# Altium schematic sheet AIR.SchDoc
size A4
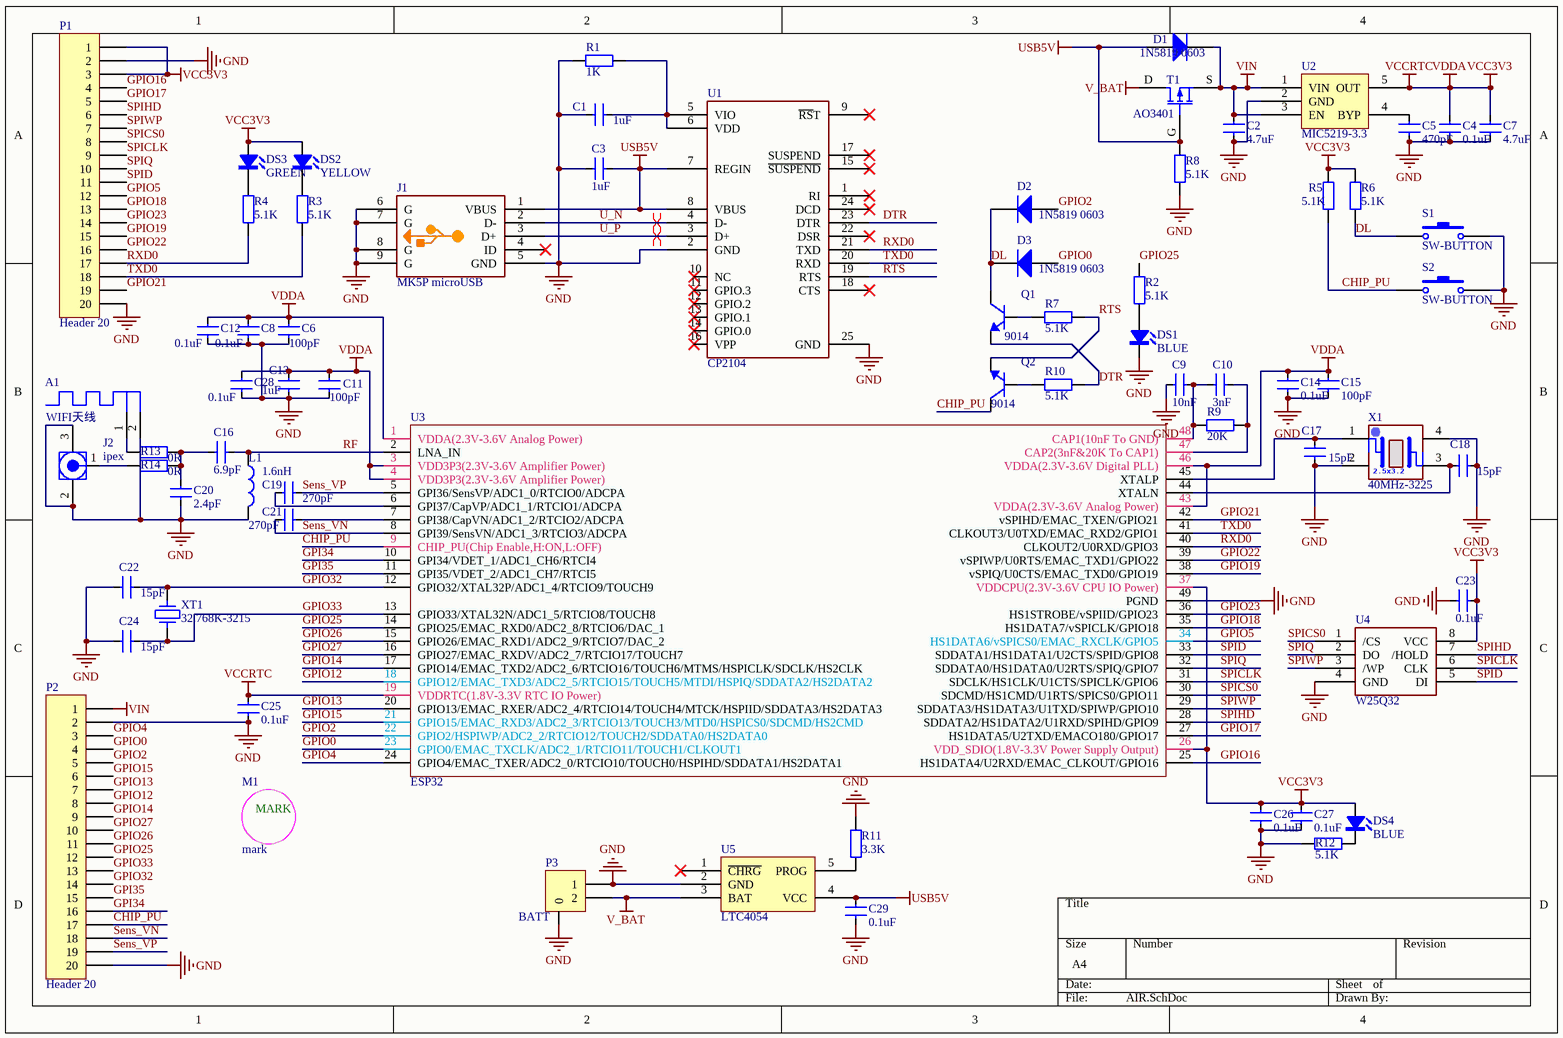
[diagram p0: AIR.SchDoc]

## Parts
A1  WIFI天线  [2.4G]
C1  1uF  [C0402]
C2  4.7uF  [C0603]
C3  1uF  [C0402]
C4  0.1uF  [C0402]
C5  470pF  [C0402]
C6  100pF  [C0402]
C7  4.7uF  [C0603]
C8  0.1uF  [C0402]
C9  10nF  [C0402]
C10  3nF  [C0402]
C11  100pF  [C0402]
C12  0.1uF  [C0402]
C13  1uF  [C0402]
C14  0.1uF  [C0402]
C15  100pF  [C0402]
C16  6.9pF  [C0402]
C17  15pF  [C0402]
C18  15pF  [C0402]
C19  270pF  [C0402]
C20  2.4pF  [C0402]
C21  270pF  [C0402]
C22  15pF  [C0402]
C23  0.1uF  [C0402]
C24  15pF  [C0402]
C25  0.1uF  [C0402]
C26  0.1uF  [C0402]
C27  0.1uF  [C0402]
C28  0.1uF  [C0402]
C29  0.1uF  [C0402]
D1  1N5819 0603  [SOD523]
D2  1N5819 0603  [SOD523]
D3  1N5819 0603  [SOD523]
DS1  BLUE  [LED0402]
DS2  YELLOW  [LED0402]
DS3  GREEN  [LED0402]
DS4  BLUE  [LED0402]
J1  MK5P microUSB  [MICROUSB]
J2  ipex  [I-PEX SOCKET]
L1  1.6nH  [L0402]
M1  mark  [ZY_UR-3X2]
P1  Header 20  [HDR1X20-M]
P2  Header 20  [HDR1X20-M]
P3  BATT  [PH1.25-T]
Q1  9014  [SOT23]
Q2  9014  [SOT23]
R1  1K  [R0402]
R2  5.1K  [R0402]
R3  5.1K  [R0402]
R4  5.1K  [R0402]
R5  5.1K  [R0402]
R6  5.1K  [R0402]
R7  5.1K  [R0402]
R8  5.1K  [R0402]
R9  20K  [R0402]
R10  5.1K  [R0402]
R11  3.3K  [R0402]
R12  5.1K  [R0402]
R13  0R  [R0402]
R14  0R  [R0402]
S1  SW-BUTTON  [MINIBUTTON]
S2  SW-BUTTON  [MINIBUTTON]
T1  AO3401  [SOT23]
U1  CP2104  [QFN24]
U2  MIC5219-3.3  [SOT23-5]
U3  ESP32  [QFN40P600X600X100-48N]
U4  W25Q32  [WSON-SPIFLASH]
U5  LTC4054  [SOT23-5]
X1  40MHz-3225  [XTAL3225]
XT1  32.768K-3215  [Y3215]

## Nets
GND: A1.2(G) C1.2 C2.1 C3.1 C4.1 C5.2 C6.1 C7.1 C8.1 C9.2 C11.1 C12.1 C13.1 C14.1 C15.1 C17.2 C18.2 C20.1 C22.1 C23.2 C24.1 C25.1 C26.1 C27.1 C28.1 C29.1 DS1.K J1.5(GND) J1.6(G) J1.7(G) J1.8(G) J1.9(G) J2.2(GND) J2.3(GND) L1.1 P1.2 P1.20 P2.2 P2.20 P3.0 P3.1 R1.1 R8.1 R11.2 R12.2 S1.2 S2.2 U1.2(GND) U1.25(GND) U2.2(GND) U3.49(PGND) U4.4(GND) U5.2(GND) X1.2(NC1) X1.4(NC2)
USB5V: C3.2 C29.2 D1.A J1.1(VBUS) R8.2 T1.G U1.7(REGIN) U1.8(VBUS) U5.4(VCC)
V_BAT: P3.2 T1.D U5.3(BAT)
VCC3V3: C4.2 C6.2 C7.2 C8.2 C11.2 C12.2 C13.2 C14.2 C15.2 C23.1 C25.2 C26.2 C27.2 C28.2 DS2.A DS3.A DS4.A P1.1 P1.3 R5.1 R6.2 U2.5(OUT) U3.1(VDDA(2.3V-3.6V_Analog_Power)) U3.3(VDD3P3(2.3V-3.6V_Amplifier_Power)) U3.4(VDD3P3(2.3V-3.6V_Amplifier_Power)) U3.19(VDDRTC(1.8V-3.3V_RTC_IO_Power)) U3.26(VDD_SDIO(1.8V-3.3V_Power_Supply_Output)) U3.37(VDDCPU(2.3V-3.6V_CPU_IO_Power)) U3.43(VDDA(2.3V-3.6V_Analog_Power)) U3.46(VDDA(2.3V-3.6V_Digital_PLL)) U4.8(VCC)  [also labelled VCCRTC, VDDA]
VIN: C2.2 D1.K P2.1 T1.S U2.1(VIN) U2.3(EN)
CHIP_PU: P2.17 Q2.C R5.2 S2.1 U3.9(CHIP_PU(Chip_Enable,H:ON,L:OFF))
DL: D2.K D3.K Q1.C R6.1 S1.1
DTR: Q1.E R10.1 U1.23(DTR)
GPI34: P2.16 U3.10(GPI34/VDET_1/ADC1_CH6/RTCI4)
GPI35: P2.15 U3.11(GPI35/VDET_2/ADC1_CH7/RTCI5)
GPIO0: D3.A P2.4 U3.23(GPIO0/EMAC_TXCLK/ADC2_1/RTCIO11/TOUCH1/CLKOUT1)
GPIO2: D2.A P2.5 U3.22(GPIO2/HSPIWP/ADC2_2/RTCIO12/TOUCH2/SDDATA0/HS2DATA0)
GPIO4: P2.3 U3.24(GPIO4/EMAC_TXER/ADC2_0/RTCIO10/TOUCH0/HSPIHD/SDDATA1/HS2DATA1)
GPIO5: P1.12 U3.34(HS1DATA6/vSPICS0/EMAC_RXCLK/GPIO5)
GPIO12: P2.8 U3.18(GPIO12/EMAC_TXD3/ADC2_5/RTCIO15/TOUCH5/MTDI/HSPIQ/SDDATA2/HS2DATA2)
GPIO13: P2.7 U3.20(GPIO13/EMAC_RXER/ADC2_4/RTCIO14/TOUCH4/MTCK/HSPIID/SDDATA3/HS2DATA3)
GPIO14: P2.9 U3.17(GPIO14/EMAC_TXD2/ADC2_6/RTCIO16/TOUCH6/MTMS/HSPICLK/SDCLK/HS2CLK)
GPIO15: P2.6 U3.21(GPIO15/EMAC_RXD3/ADC2_3/RTCIO13/TOUCH3/MTD0/HSPICS0/SDCMD/HS2CMD)
GPIO16: P1.4 U3.25(HS1DATA4/U2RXD/EMAC_CLKOUT/GPIO16)
GPIO17: P1.5 U3.27(HS1DATA5/U2TXD/EMACO180/GPIO17)
GPIO18: P1.13 U3.35(HS1DATA7/vSPICLK/GPIO18)
GPIO19: P1.15 U3.38(vSPIQ/U0CTS/EMAC_TXD0/GPIO19)
GPIO21: P1.19 U3.42(vSPIHD/EMAC_TXEN/GPIO21)
GPIO22: P1.16 U3.39(vSPIWP/U0RTS/EMAC_TXD1/GPIO22)
GPIO23: P1.14 U3.36(HS1STROBE/vSPIID/GPIO23)
GPIO25: P2.12 R2.2 U3.14(GPIO25/EMAC_RXD0/ADC2_8/RTCIO6/DAC_1)
GPIO26: P2.11 U3.15(GPIO26/EMAC_RXD1/ADC2_9/RTCIO7/DAC_2)
GPIO27: P2.10 U3.16(GPIO27/EMAC_RXDV/ADC2_7/RTCIO17/TOUCH7)
GPIO32: C22.2 P2.14 U3.12(GPIO32/XTAL32P/ADC1_4/RTCIO9/TOUCH9) XT1.2
GPIO33: C24.2 P2.13 U3.13(GPIO33/XTAL32N/ADC1_5/RTCIO8/TOUCH8) XT1.1
RF: C16.2 L1.2 U3.2(LNA_IN)
RTS: Q2.E R7.1 U1.19(RTS)
RXD0: P1.17 R4.1 U1.21(TXD) U3.40(CLKOUT2/U0RXD/GPIO3)
Sens_VN: C21.1 P2.18 U3.8(GPI39/SensVN/ADC1_3/RTCIO3/ADCPA)
Sens_VP: C19.2 P2.19 U3.5(GPI36/SensVP/ADC1_0/RTCIO0/ADCPA)
SPICLK: P1.9 U3.31(SDCLK/HS1CLK/U1CTS/SPICLK/GPIO6) U4.6(CLK)
SPICS0: P1.8 U3.30(SDCMD/HS1CMD/U1RTS/SPICS0/GPIO11) U4.1(/CS)
SPID: P1.11 U3.33(SDDATA1/HS1DATA1/U2CTS/SPID/GPIO8) U4.5(DI)
SPIHD: P1.6 U3.28(SDDATA2/HS1DATA2/U1RXD/SPIHD/GPIO9) U4.7(/HOLD)
SPIQ: P1.10 U3.32(SDDATA0/HS1DATA0/U2RTS/SPIQ/GPIO7) U4.2(DO)
SPIWP: P1.7 U3.29(SDDATA3/HS1DATA3/U1TXD/SPIWP/GPIO10) U4.3(/WP)
TXD0: P1.18 R3.1 U1.20(RXD) U3.41(CLKOUT3/U0TXD/EMAC_RXD2/GPIO1)
U_N: J1.2(D-) U1.4(D-)
U_P: J1.3(D+) U1.3(D+)
NetA1_1: A1.1 R13.2
NetC1_1: C1.1 R1.2 U1.5(VIO) U1.6(VDD)
NetC5_1: C5.1 U2.4(BYP)
NetC9_1: C9.1 C10.2 R9.2 U3.48(CAP1(10nF_To_GND))
NetC10_1: C10.1 R9.1 U3.47(CAP2(3nF&20K_To_CAP1))
NetC16_1: C16.1 C20.2 R13.1 R14.1
NetC17_1: C17.1 U3.45(XTALP) X1.1(X1)
NetC18_1: C18.1 U3.44(XTALN) X1.3(X2)
NetC19_1: C19.1 U3.6(GPI37/CapVP/ADC1_1/RTCIO1/ADCPA)
NetC21_2: C21.2 U3.7(GPI38/CapVN/ADC1_2/RTCIO2/ADCPA)
NetDS1_A: DS1.A R2.1
NetDS2_K: DS2.K R3.2
NetDS3_K: DS3.K R4.2
NetDS4_K: DS4.K R12.1
NetJ2_1: J2.1(Signal) R14.2
NetQ1_B: Q1.B R7.2
NetQ2_B: Q2.B R10.2
NetR11_1: R11.1 U5.5(PROG)

Not connected (* = marked no-connect by the designer): J1 4(ID)*; U1 1(RI)* 9(~{RS}T)* 10(NC)* 11(GPIO.3)* 12(GPIO.2)* 13(GPIO.1)* 14(GPIO.0)* 15(~{SUSPEND})* 16(VPP)* 17(SUSPEND)* 18(CTS)* 22(DSR)* 24(DCD)*; U5 1(~{CHRG})*

## Layout directives
differential pair: U_N, U_P

## Notes on the sheet
- (in symbol mark) MARK
- (in symbol XTAL3225) 2.5x3.2

## Library data of the parts
A1 = ANT2.4G
C1-C15 C17-C19 C21-C29 = CAP: 普通小电容
C16 C20 = CAP: 射频电容
D1-D3 = Diode: 普通二极管
DS1-DS4 = LED
J1 = MICRO_USB: 4固定脚microUSB座
J2 = MCX_IPEX
L1 = L0402: 射频电感
P1 P2 = Header 20: Header, 20-Pin; LatestRevisionDate: 17-Jul-2002; LatestRevisionNote: Re-released for DXP Platform.; Publisher: Altium Limited
P3 = Header 2T: Header, 4-Pin; LatestRevisionDate: 17-Jul-2002; LatestRevisionNote: Re-released for DXP Platform.; Publisher: Altium Limited
Q1 Q2 = NPN: NPN三极管; pin to pad: B>1 C>3 E>2; Published: 8-Jun-2000; LatestRevisionDate: 15-Jan-2003; LatestRevisionNote: PCB Footprint 'BCY-W3/D4.7' replaced; DatasheetDocument: 1997; PackageDocument: Sep-1998; PackageReference: TO-92A; Publisher: Altium Limited; Code_JEDEC: TO-92A; ComponentLink1Description: Manufacturer Link; ComponentLink1URL: http://www.fairchildsemi.com/; ComponentLink2Description: Datasheet; ComponentLink2URL: http://www.fairchildsemi.com/ds/2N%2F2N3904.pdf
R1-R14 = RES: 普通电阻
T1 = MOS-P: pin to pad: D>3 G>1 S>2
U2 = MIC5219
U4 = SPIFLASH_SOP8W
U5 = LTC4054: 锂电池管理芯片
X1 = XTAL3225
XT1 = XT: 晶振